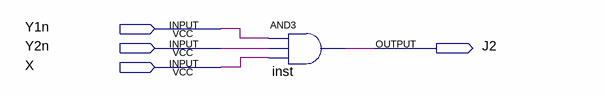
[diagram p0: schematic sheet]
// Quartus schematic J2.bdf as structural Verilog: 1 symbols, 4 pins
module J2 (
  input  Y1n,
  input  Y2n,
  input  X,
  output J2
);

  and inst (J2, Y1n, Y2n, X);
endmodule
